# EAGLE schematic ANET3D_Board (EAGLE 6.6.0)
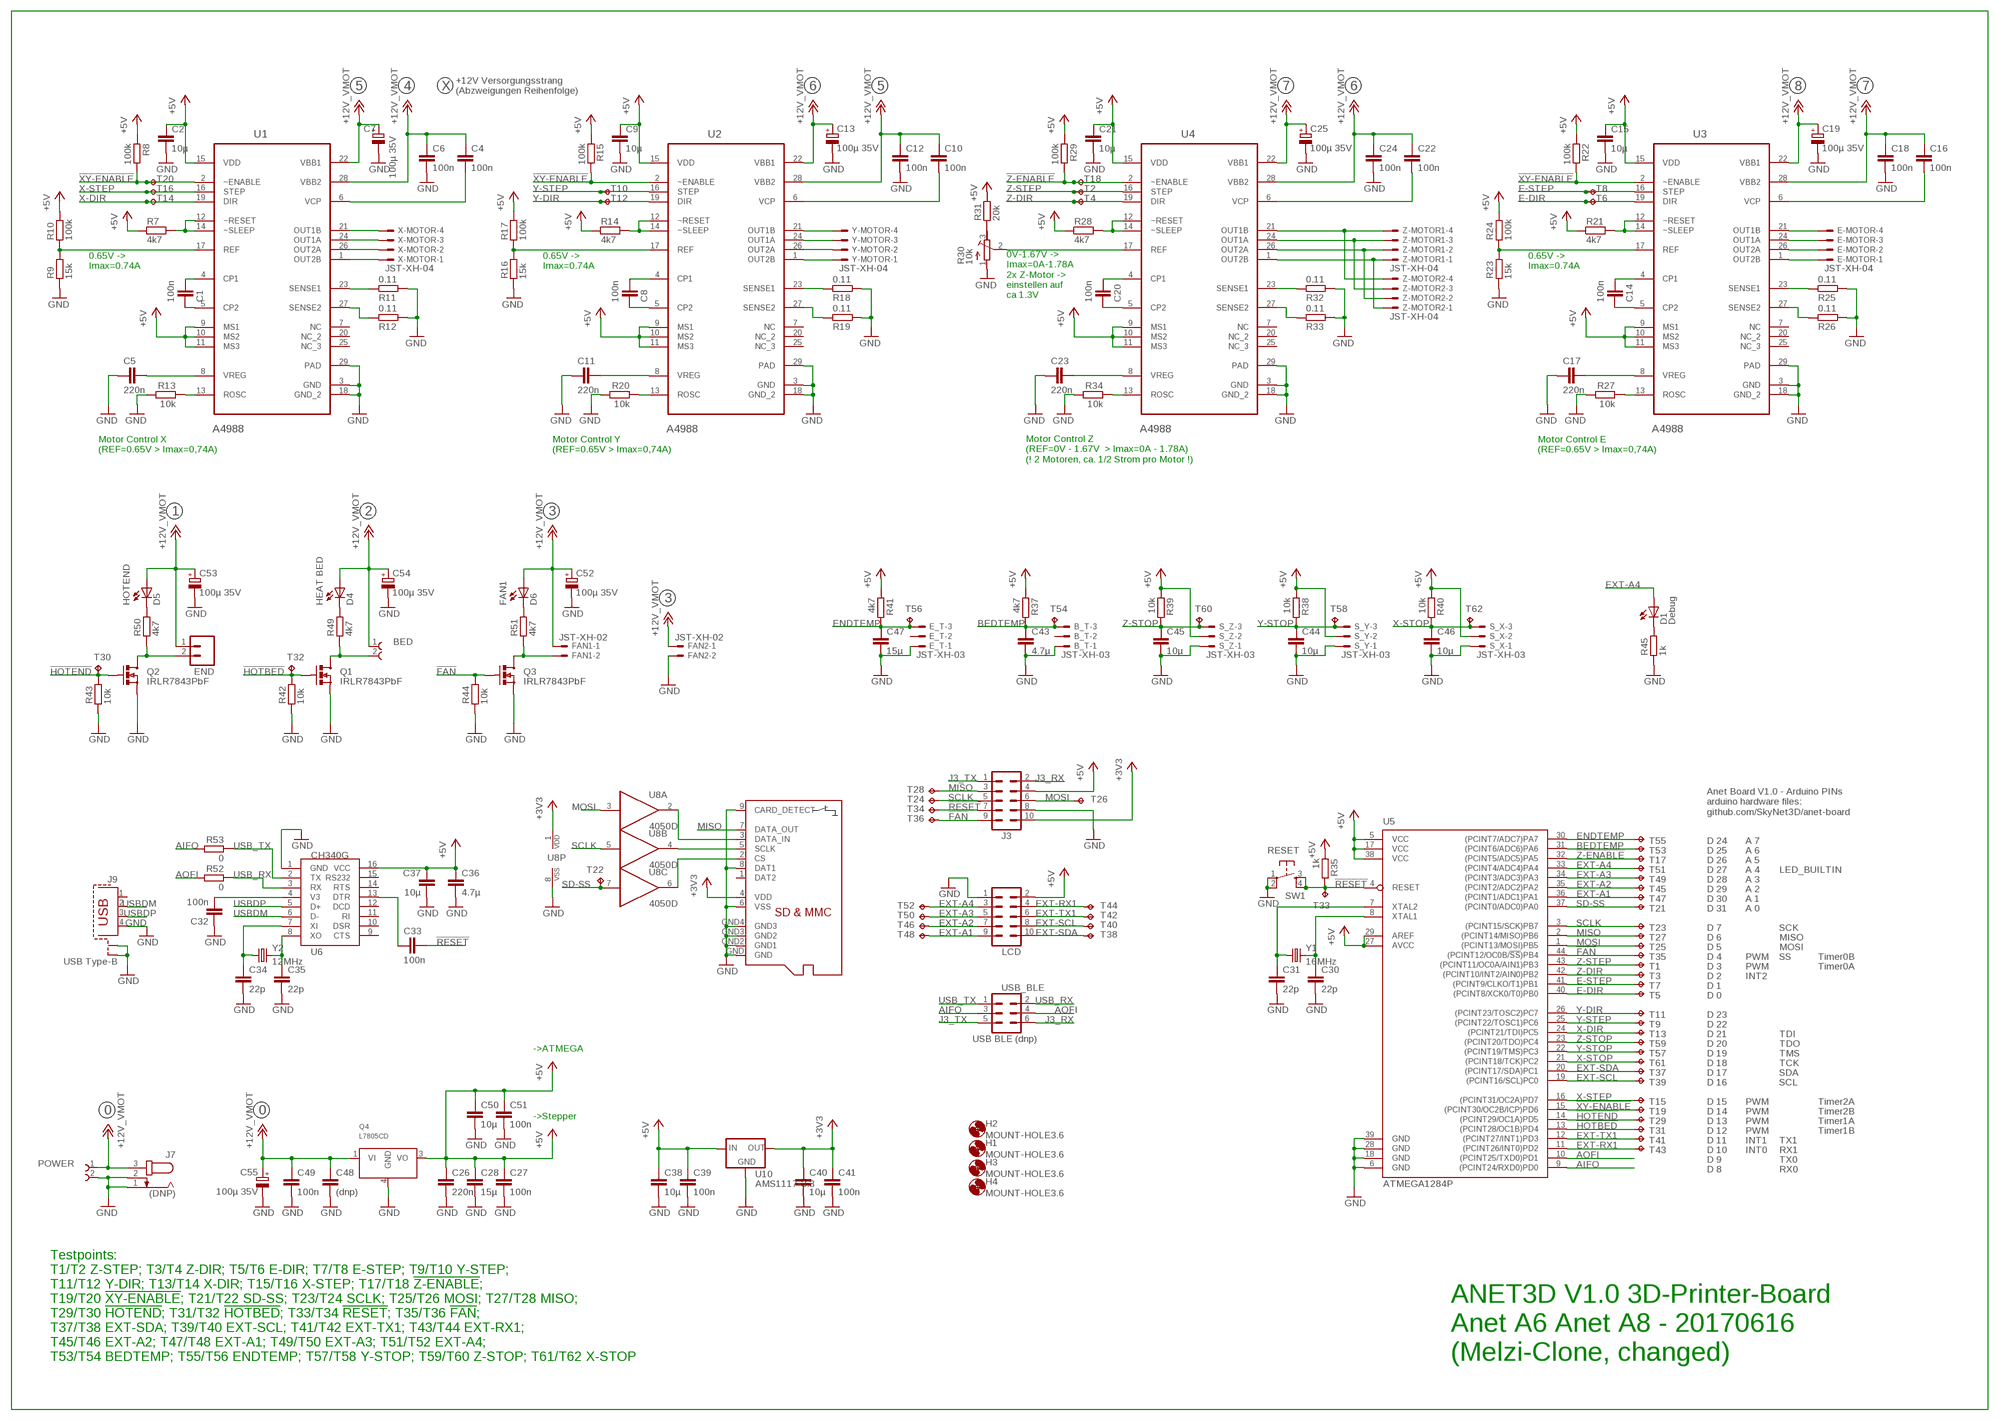
[diagram p0: schematic, sheet 1]

## Parts
B_T  JST-XH-03  JST-XH-03-PIN-ROUND-PAD  [JST-XH-03-PACKAGE-ROUND-PAD]
BED  691311400002  [691311400002]
C1  100n  C-EUC0805  [C0805]
C2  10µ  C-EUC0805  [C0805]
C4  100n  C-EUC0805  [C0805]
C5  220n  C-EUC0805  [C0805]
C6  100n  C-EUC0805  [C0805]
C7  100µ 35V  CPOL-EUD  [PANASONIC_D]
C8  100n  C-EUC0805  [C0805]
C9  10µ  C-EUC0805  [C0805]
C10  100n  C-EUC0805  [C0805]
C11  220n  C-EUC0805  [C0805]
C12  100n  C-EUC0805  [C0805]
C13  100µ 35V  CPOL-EUD  [PANASONIC_D]
C14  100n  C-EUC0805  [C0805]
C15  10µ  C-EUC0805  [C0805]
C16  100n  C-EUC0805  [C0805]
C17  220n  C-EUC0805  [C0805]
C18  100n  C-EUC0805  [C0805]
C19  100µ 35V  CPOL-EUD  [PANASONIC_D]
C20  100n  C-EUC0805  [C0805]
C21  10µ  C-EUC0805  [C0805]
C22  100n  C-EUC0805  [C0805]
C23  220n  C-EUC0805  [C0805]
C24  100n  C-EUC0805  [C0805]
C25  100µ 35V  CPOL-EUD  [PANASONIC_D]
C26  220n  C-EUC0805  [C0805]
C27  100n  C-EUC0805  [C0805]
C28  15µ  C-EUC0805  [C0805]
C30  22p  C-EUC0805  [C0805]
C31  22p  C-EUC0805  [C0805]
C32  100n  C-EUC0805  [C0805]
C33  100n  C-EUC0805  [C0805]
C34  22p  C-EUC0805  [C0805]
C35  22p  C-EUC0805  [C0805]
C36  4.7µ  C-EUC0805  [C0805]
C37  10µ  C-EUC0805  [C0805]
C38  10µ  C-EUC0805  [C0805]
C39  100n  C-EUC0805  [C0805]
C40  10µ  C-EUC0805  [C0805]
C41  100n  C-EUC0805  [C0805]
C43  4.7µ  C-EUC0805  [C0805]
C44  10µ  C-EUC0805  [C0805]
C45  10µ  C-EUC0805  [C0805]
C46  10µ  C-EUC0805  [C0805]
C47  15µ  C-EUC0805  [C0805]
C48  (dnp)  C-EUC0805  [C0805]
C49  100n  C-EUC0805  [C0805]
C50  10µ  C-EUC0805  [C0805]
C51  100n  C-EUC0805  [C0805]
C52  100µ 35V  CPOL-EUD  [PANASONIC_D]
C53  100µ 35V  CPOL-EUD  [PANASONIC_D]
C54  100µ 35V  CPOL-EUD  [PANASONIC_D]
C55  100µ 35V  CPOL-EUD  [PANASONIC_D]
D1  Debug  LEDCHIPLED_0805  [CHIPLED_0805]
D4  HEAT BED  LEDCHIPLED_0805  [CHIPLED_0805]
D5  HOTEND  LEDCHIPLED_0805  [CHIPLED_0805]
D6  FAN1  LEDCHIPLED_0805  [CHIPLED_0805]
E-MOTOR  JST-XH-04  JST-XH-04-PIN-ROUND-PAD  [JST-XH-04-PACKAGE-ROUND-PAD]
E_T  JST-XH-03  JST-XH-03-PIN-ROUND-PAD  [JST-XH-03-PACKAGE-ROUND-PAD]
END  M025MM  [SCREWTERMINAL-5MM-2]
FAN1  JST-XH-02  JST-XH-02-PIN-ROUND-PAD  [JST-XH-02-PACKAGE-ROUND-PAD]
FAN2  JST-XH-02  JST-XH-02-PIN-ROUND-PAD  [JST-XH-02-PACKAGE-ROUND-PAD]
H1  MOUNT-HOLE3.6  [3,6]
H2  MOUNT-HOLE3.6  [3,6]
H3  MOUNT-HOLE3.6  [3,6]
H4  MOUNT-HOLE3.6  [3,6]
J3  J3  ML10  [ML10]
J7  (DNP)  JACK-PLUG1  [SPC4078]
J9  USB Type-B  PN61729-S  [PN61729-S]
LCD  LCD  ML10  [ML10]
POWER  691311400002  [691311400002]
Q1  IRLR7843PbF  MOSFET-NCHANNELFDD8580  [DPAK]
Q2  IRLR7843PbF  MOSFET-NCHANNELFDD8580  [DPAK]
Q3  IRLR7843PbF  MOSFET-NCHANNELFDD8580  [DPAK]
Q4  L7805CD  78XX  [D2PACK]
R7  4k7  RESISTOR_0805  [RESC2012X70N]
R8  100k  RESISTOR_0805  [RESC2012X70N]
R9  15k  RESISTOR_0805  [RESC2012X70N]
R10  100k  RESISTOR_0805  [RESC2012X70N]
R11  0.11  RESISTOR_0805  [RESC2012X70N]
R12  0.11  RESISTOR_0805  [RESC2012X70N]
R13  10k  RESISTOR_0805  [RESC2012X70N]
R14  4k7  RESISTOR_0805  [RESC2012X70N]
R15  100k  RESISTOR_0805  [RESC2012X70N]
R16  15k  RESISTOR_0805  [RESC2012X70N]
R17  100k  RESISTOR_0805  [RESC2012X70N]
R18  0.11  RESISTOR_0805  [RESC2012X70N]
R19  0.11  RESISTOR_0805  [RESC2012X70N]
R20  10k  RESISTOR_0805  [RESC2012X70N]
R21  4k7  RESISTOR_0805  [RESC2012X70N]
R22  100k  RESISTOR_0805  [RESC2012X70N]
R23  15k  RESISTOR_0805  [RESC2012X70N]
R24  100k  RESISTOR_0805  [RESC2012X70N]
R25  0.11  RESISTOR_0805  [RESC2012X70N]
R26  0.11  RESISTOR_0805  [RESC2012X70N]
R27  10k  RESISTOR_0805  [RESC2012X70N]
R28  4k7  RESISTOR_0805  [RESC2012X70N]
R29  100k  RESISTOR_0805  [RESC2012X70N]
R30  10k  R-TRIMM3374  [RTRIM3374]
R31  20k  RESISTOR_0805  [RESC2012X70N]
R32  0.11  RESISTOR_0805  [RESC2012X70N]
R33  0.11  RESISTOR_0805  [RESC2012X70N]
R34  10k  RESISTOR_0805  [RESC2012X70N]
R35  1k  RESISTOR_0805  [RESC2012X70N]
R37  4k7  RESISTOR_0805  [RESC2012X70N]
R38  10k  RESISTOR_0805  [RESC2012X70N]
R39  10k  RESISTOR_0805  [RESC2012X70N]
R40  10k  RESISTOR_0805  [RESC2012X70N]
R41  4k7  RESISTOR_0805  [RESC2012X70N]
R42  10k  RESISTOR_0805  [RESC2012X70N]
R43  10k  RESISTOR_0805  [RESC2012X70N]
R44  10k  RESISTOR_0805  [RESC2012X70N]
R45  1k  RESISTOR_0805  [RESC2012X70N]
R49  4k7  RESISTOR_0805  [RESC2012X70N]
R50  4k7  RESISTOR_0805  [RESC2012X70N]
R51  4k7  RESISTOR_0805  [RESC2012X70N]
R52  0  RESISTOR_0805  [RESC2012X70N]
R53  0  RESISTOR_0805  [RESC2012X70N]
S_X  JST-XH-03  JST-XH-03-PIN-ROUND-PAD  [JST-XH-03-PACKAGE-ROUND-PAD]
S_Y  JST-XH-03  JST-XH-03-PIN-ROUND-PAD  [JST-XH-03-PACKAGE-ROUND-PAD]
S_Z  JST-XH-03  JST-XH-03-PIN-ROUND-PAD  [JST-XH-03-PACKAGE-ROUND-PAD]
SD  MICRO-SD-PP  [MICRO-SD-PP]
SW1  RESET  TAC_SWITCHSMD  [TACTILE_SWITCH_SMD]
T1  TPTP09R  [TP09R]
T2  TPTP09R  [TP09R]
T3  TPTP09R  [TP09R]
T4  TPTP09R  [TP09R]
T5  TPTP09R  [TP09R]
T6  TPTP09R  [TP09R]
T7  TPTP09R  [TP09R]
T8  TPTP09R  [TP09R]
T9  TPTP09R  [TP09R]
T10  TPTP09R  [TP09R]
T11  TPTP09R  [TP09R]
T12  TPTP09R  [TP09R]
T13  TPTP09R  [TP09R]
T14  TPTP09R  [TP09R]
T15  TPTP09R  [TP09R]
T16  TPTP09R  [TP09R]
T17  TPTP09R  [TP09R]
T18  TPTP09R  [TP09R]
T19  TPTP09R  [TP09R]
T20  TPTP09R  [TP09R]
T21  TPTP09R  [TP09R]
T22  TPTP09R  [TP09R]
T23  TPTP09R  [TP09R]
T24  TPTP09R  [TP09R]
T25  TPTP09R  [TP09R]
T26  TPTP09R  [TP09R]
T27  TPTP09R  [TP09R]
T28  TPTP09R  [TP09R]
T29  TPTP09R  [TP09R]
T30  TPTP09R  [TP09R]
T31  TPTP09R  [TP09R]
T32  TPTP09R  [TP09R]
T33  TPTP09R  [TP09R]
T34  TPTP09R  [TP09R]
T35  TPTP09R  [TP09R]
T36  TPTP09R  [TP09R]
T37  TPTP09R  [TP09R]
T38  TPTP09R  [TP09R]
T39  TPTP09R  [TP09R]
T40  TPTP09R  [TP09R]
T41  TPTP09R  [TP09R]
T42  TPTP09R  [TP09R]
T43  TPTP09R  [TP09R]
T44  TPTP09R  [TP09R]
T45  TPTP09R  [TP09R]
T46  TPTP09R  [TP09R]
T47  TPTP09R  [TP09R]
T48  TPTP09R  [TP09R]
T49  TPTP09R  [TP09R]
T50  TPTP09R  [TP09R]
T51  TPTP09R  [TP09R]
T52  TPTP09R  [TP09R]
T53  TPTP09R  [TP09R]
T54  TPTP09R  [TP09R]
T55  TPTP09R  [TP09R]
T56  TPTP09R  [TP09R]
T57  TPTP09R  [TP09R]
T58  TPTP09R  [TP09R]
T59  TPTP09R  [TP09R]
T60  TPTP09R  [TP09R]
T61  TPTP09R  [TP09R]
T62  TPTP09R  [TP09R]
U1  A4988  A4988SETTR-T-RE  [QFN50P500X500X100-29N]
U2  A4988  A4988SETTR-T-RE  [QFN50P500X500X100-29N]
U3  A4988  A4988SETTR-T-RE  [QFN50P500X500X100-29N]
U4  A4988  A4988SETTR-T-RE  [QFN50P500X500X100-29N]
U5  ATMEGA1284P  ATMEGA644A  [TQFP44]
U6  CH340G  [SOIC16]
U8  4050D  [SO16]
U10  AMS1117-3.3  LM1117DTX-SOT89  [SOT89]
USB_BLE  USB BLE (dnp)  MA03-2  [MA03-2]
X-MOTOR  JST-XH-04  JST-XH-04-PIN-ROUND-PAD  [JST-XH-04-PACKAGE-ROUND-PAD]
Y1  16MHz  CRYSTALSM49  [SM49]
Y2  12MHz  CRYSTALSM49  [SM49]
Y-MOTOR  JST-XH-04  JST-XH-04-PIN-ROUND-PAD  [JST-XH-04-PACKAGE-ROUND-PAD]
Z-MOTOR1  JST-XH-04  JST-XH-04-PIN-ROUND-PAD  [JST-XH-04-PACKAGE-ROUND-PAD]
Z-MOTOR2  JST-XH-04  JST-XH-04-PIN-ROUND-PAD  [JST-XH-04-PACKAGE-ROUND-PAD]

## Nets
0: C32.2 U6.4(V3)
!FAN: J3.9 Q3.1(G) R44.2 T35.TP T36.TP U5.44((PCINT12/OC0B/!SS!)PB4)
!HOTBED: Q1.1(G) R42.2 T31.TP T32.TP U5.13((PCINT28/OC1B)PD4)
!HOTEND: Q2.1(G) R43.2 T29.TP T30.TP U5.14((PCINT29/OC1A)PD5)
!RESET: C33.2 J3.7 R35.2 SW1.3 SW1.4 T33.TP T34.TP U5.4(RESET)
!XY-ENABLE: R8.2 R15.2 R22.2 T19.TP T20.TP U1.2(~ENABLE) U2.2(~ENABLE) U3.2(~ENABLE) U5.15((PCINT30/OC2B/ICP)PD6)
!Z-ENABLE: R29.2 T17.TP T18.TP U4.2(~ENABLE) U5.32((PCINT5/ADC5)PA5)
+3V3: C40.1 C41.1 J3.10 SD.4(VDD) U8.1(P:VDD) U10.2(OUT)
+5V [power]: C2.1 C9.1 C15.1 C21.1 C26.1 C27.1 C28.1 C36.1 C37.1 C38.1 C39.1 C50.1 C51.1 J3.4 LCD.2 Q4.3(VO) R7.1 R8.1 R10.2 R14.1 R15.1 R17.2 R21.1 R22.1 R24.2 R28.1 R29.1 R31.2 R35.1 R37.1 R38.1 R39.1 R40.1 R41.1 S_X.2 S_Y.2 S_Z.2 U1.9(MS1) U1.10(MS2) U1.11(MS3) U1.15(VDD) U2.9(MS1) U2.10(MS2) U2.11(MS3) U2.15(VDD) U3.9(MS1) U3.10(MS2) U3.11(MS3) U3.15(VDD) U4.9(MS1) U4.10(MS2) U4.11(MS3) U4.15(VDD) U5.5(VCC) U5.17(VCC) U5.27(AVCC) U5.29(AREF) U5.38(VCC) U6.16(VCC) U10.3(IN)
+12V: BED.1 C4.1 C6.1 C7.+ C10.1 C12.1 C13.+ C16.1 C18.1 C19.+ C22.1 C24.1 C25.+ C48.1 C49.1 C52.+ C53.+ C54.+ C55.+ D4.A D5.A D6.A END.1 FAN1.1 FAN2.1 J7.3 POWER.1 Q4.1(VI) U1.22(VBB1) U1.28(VBB2) U2.22(VBB1) U2.28(VBB2) U3.22(VBB1) U3.28(VBB2) U4.22(VBB1) U4.28(VBB2) ; supply symbol labelled +12V_VMOT
AIFO: R53.2 U5.9((PCINT24/RXD0)PD0) USB_BLE.3
AOFI: R52.2 U5.10((PCINT25/TXD0)PD1) USB_BLE.4
BEDTEMP: B_T.3 C43.1 R37.2 T53.TP T54.TP U5.31((PCINT6/ADC6)PA6)
E-DIR: T5.TP T6.TP U3.19(DIR) U5.40((PCINT8/XCK0/T0)PB0)
E-STEP: T7.TP T8.TP U3.16(STEP) U5.41((PCINT9/CLKO/T1)PB1)
ENDTEMP: C47.1 E_T.3 R41.2 T55.TP T56.TP U5.30((PCINT7/ADC7)PA7)
EXT-A1: LCD.9 T47.TP T48.TP U5.36((PCINT1/ADC1)PA1)
EXT-A2: LCD.7 T45.TP T46.TP U5.35((PCINT2/ADC2)PA2)
EXT-A3: LCD.5 T49.TP T50.TP U5.34((PCINT3/ADC3)PA3)
EXT-A4: D1.A LCD.3 T51.TP T52.TP U5.33((PCINT4/ADC4)PA4)
EXT-RX1: LCD.4 T43.TP T44.TP U5.11((PCINT26/INT0)PD2)
EXT-SCL: LCD.8 T39.TP T40.TP U5.19((PCINT16/SCL)PC0)
EXT-SDA: LCD.10 T37.TP T38.TP U5.20((PCINT17/SDA)PC1)
EXT-TX1: LCD.6 T41.TP T42.TP U5.12((PCINT27/INT1)PD3)
GND: B_T.1 C2.2 C5.1 C6.2 C7.- C9.2 C11.1 C12.2 C13.- C15.2 C17.1 C18.2 C19.- C21.2 C23.1 C24.2 C25.- C26.2 C27.2 C28.2 C30.2 C31.2 C32.1 C34.2 C35.2 C36.2 C37.2 C38.2 C39.2 C40.2 C41.2 C43.2 C44.2 C45.2 C46.2 C47.2 C48.2 C49.2 C50.2 C51.2 C52.- C53.- C54.- C55.- E_T.1 FAN2.2 J3.8 J7.1 J7.2 J9.4 J9.S1 J9.S2 LCD.1 POWER.2 Q1.3(S) Q2.3(S) Q3.3(S) Q4.4(GND) R9.1 R11.2 R12.2 R13.2 R16.1 R18.2 R19.2 R20.2 R23.1 R25.2 R26.2 R27.2 R30.1(A) R32.2 R33.2 R34.2 R42.1 R43.1 R44.1 R45.1 S_X.1 S_Y.1 S_Z.1 SD.6(VSS) SD.8(DAT1) SD.9(CARD_DETECT) SD.GND SD.GND2(GND1) SD.GND3(GND2) SD.GND4(GND3) SW1.1 SW1.2 U1.3(GND) U1.18(GND_2) U1.29(PAD) U2.3(GND) U2.18(GND_2) U2.29(PAD) U3.3(GND) U3.18(GND_2) U3.29(PAD) U4.3(GND) U4.18(GND_2) U4.29(PAD) U5.6(GND) U5.18(GND) U5.28(GND) U5.39(GND) U6.1(GND) U8.8(P:VSS) U10.1(GND)
HOTBED-GND [power]: BED.2 Q1.4(D) R49.1
HOTBED-GND3 [power]: END.2 Q2.4(D) R50.1
HOTBED-GND4 [power]: FAN1.2 Q3.4(D) R51.1
J3_RX: J3.2 USB_BLE.6
J3_TX: J3.1 USB_BLE.5
MISO: J3.3 SD.7(DATA_OUT) T27.TP T28.TP U5.2((PCINT14/MISO)PB6)
MOSI: J3.6 T25.TP T26.TP U5.1((PCINT13/MOSI)PB5) U8.3(A:I)
N$1: R13.1 U1.13(ROSC)
N$2: D4.C R49.2
N$3: D5.C R50.2
N$4: C5.2 U1.8(VREG)
N$5: C1.2 U1.4(CP1)
N$6: C1.1 U1.5(CP2)
N$7: D6.C R51.2
N$8: R7.2 U1.12(~RESET) U1.14(~SLEEP)
N$9: C4.2 U1.6(VCP)
N$10: D1.C R45.2
N$11: C31.1 U5.7(XTAL2) Y1.1
N$12: SD.3(DATA_IN) U8.2(A:O)
N$13: SD.5(SCLK) U8.4(B:O)
N$14: SD.2(CS) U8.6(C:O)
N$15: C30.1 U5.8(XTAL1) Y1.2
N$16: U1.1(OUT2B) X-MOTOR.1
N$17: U1.21(OUT1B) X-MOTOR.4
N$18: C33.1 U6.13(DTR)
N$19: U1.26(OUT2A) X-MOTOR.2
N$20: U1.24(OUT1A) X-MOTOR.3
N$21: R12.1 U1.27(SENSE2)
N$22: U4.24(OUT1A) Z-MOTOR1.3 Z-MOTOR2.3
N$23: U4.26(OUT2A) Z-MOTOR1.2 Z-MOTOR2.2
N$24: U4.21(OUT1B) Z-MOTOR1.4 Z-MOTOR2.4
N$25: U4.1(OUT2B) Z-MOTOR1.1 Z-MOTOR2.1
N$26: C34.1 U6.7(XI) Y2.1
N$27: R32.1 U4.23(SENSE1)
N$28: R33.1 U4.27(SENSE2)
N$29: C20.2 U4.4(CP1)
N$30: C20.1 U4.5(CP2)
N$31: R34.1 U4.13(ROSC)
N$32: R11.1 U1.23(SENSE1)
N$33: C23.2 U4.8(VREG)
N$34: R28.2 U4.12(~RESET) U4.14(~SLEEP)
N$35: C22.2 U4.6(VCP)
N$36: R30.3(E) R31.1
N$37: R30.2(S) U4.17(REF)
N$38: E-MOTOR.3 U3.24(OUT1A)
N$39: U2.21(OUT1B) Y-MOTOR.4
N$40: U2.26(OUT2A) Y-MOTOR.2
N$41: E-MOTOR.1 U3.1(OUT2B)
N$42: R25.1 U3.23(SENSE1)
N$43: R26.1 U3.27(SENSE2)
N$44: C14.2 U3.4(CP1)
N$45: C14.1 U3.5(CP2)
N$46: R27.1 U3.13(ROSC)
N$47: C17.2 U3.8(VREG)
N$48: R21.2 U3.12(~RESET) U3.14(~SLEEP)
N$49: C16.2 U3.6(VCP)
N$50: E-MOTOR.4 U3.21(OUT1B)
N$51: E-MOTOR.2 U3.26(OUT2A)
N$78: C35.1 U6.8(XO) Y2.2
N$96: U2.24(OUT1A) Y-MOTOR.3
N$99: U2.1(OUT2B) Y-MOTOR.1
N$100: R18.1 U2.23(SENSE1)
N$101: R19.1 U2.27(SENSE2)
N$102: C8.2 U2.4(CP1)
N$103: C8.1 U2.5(CP2)
N$104: R20.1 U2.13(ROSC)
N$105: C11.2 U2.8(VREG)
N$106: R14.2 U2.12(~RESET) U2.14(~SLEEP)
N$107: C10.2 U2.6(VCP)
REF1: R9.2 R10.1 U1.17(REF)
REF2: R16.2 R17.1 U2.17(REF)
REF3: R23.2 R24.1 U3.17(REF)
SCLK: J3.5 T23.TP T24.TP U5.3((PCINT15/SCK)PB7) U8.5(B:I)
SD-SS: T21.TP T22.TP U5.37((PCINT0/ADC0)PA0) U8.7(C:I)
USB_RX: R52.1 U6.3(RX) USB_BLE.2
USB_TX: R53.1 U6.2(TX) USB_BLE.1
USBDM: J9.2 U6.6(D-)
USBDP: J9.3 U6.5(D+)
X-DIR: T13.TP T14.TP U1.19(DIR) U5.24((PCINT21/TDI)PC5)
X-STEP: T15.TP T16.TP U1.16(STEP) U5.16((PCINT31/OC2A)PD7)
X-STOP: C46.1 R40.2 S_X.3 T61.TP T62.TP U5.21((PCINT18/TCK)PC2)
Y-DIR: T11.TP T12.TP U2.19(DIR) U5.26((PCINT23/TOSC2)PC7)
Y-STEP: T9.TP T10.TP U2.16(STEP) U5.25((PCINT22/TOSC1)PC6)
Y-STOP: C44.1 R38.2 S_Y.3 T57.TP T58.TP U5.22((PCINT19/TMS)PC3)
Z-DIR: T3.TP T4.TP U4.19(DIR) U5.42((PCINT10/INT2/AIN0)PB2)
Z-STEP: T1.TP T2.TP U4.16(STEP) U5.43((PCINT11/OC0A/AIN1)PB3)
Z-STOP: C45.1 R39.2 S_Z.3 T59.TP T60.TP U5.23((PCINT20/TDO)PC4)
Unconnected: B_T.2 E_T.2 J9.1 SD.1(DAT2) U1.7(NC) U1.20(NC_2) U1.25(NC_3) U2.7(NC) U2.20(NC_2) U2.25(NC_3) U3.7(NC) U3.20(NC_2) U3.25(NC_3) U4.7(NC) U4.20(NC_2) U4.25(NC_3) U6.9(CTS) U6.10(DSR) U6.11(RI) U6.12(DCD) U6.14(RTS) U6.15(RS232) U8.9(D:I) U8.10(D:O) U8.11(E:I) U8.12(E:O) U8.14(F:I) U8.15(F:O)

## Notes on the sheet
- 5 | 4 | X
- +12V Versorgungsstrang
  (Abzweigungen Reihenfolge)
- 6 | 5 | 7 | 6 | 8 | 7
- 0.65V ->
  Imax=0.74A
- 0.65V ->
  Imax=0.74A
- 0.65V ->
  Imax=0.74A
- 0V-1.67V ->
  Imax=0A-1.78A
  2x Z-Motor ->
  einstellen auf
  ca 1.3V
- Motor Control X
  (REF=0.65V > Imax=0,74A)
- Motor Control Y
  (REF=0.65V > Imax=0,74A)
- Motor Control E
  (REF=0.65V > Imax=0,74A)
- Motor Control Z
  (REF=0V - 1.67V  > Imax=0A - 1.78A)
  (! 2 Motoren, ca. 1/2 Strom pro Motor !)
- 1 | 2 | 3
- 3
- Anet Board V1.0 - Arduino PINs
  arduino hardware files:
  github.com/SkyNet3D/anet-board
- D 24 | A 7
- D 25 | A 6
- D 26 | A 5
- D 27 | A 4 | LED_BUILTIN
- D 28 | A 3
- D 29 | A 2
- D 30 | A 1
- D 31 | A 0
- D 7 | SCK
- D 6 | MISO
- D 5 | MOSI
- U6
- D 4 | PWM | SS | Timer0B
- D 3 | PWM | Timer0A
- D 2 | INT2
- D 1
- D 0
- D 23
- D 22
- D 21 | TDI
- D 20 | TDO
- ->ATMEGA
- D 19 | TMS
- D 18 | TCK
- D 17 | SDA
- D 16 | SCL
- D 15 | PWM | Timer2A
- 0 | 0
- D 14 | PWM | Timer2B
- ->Stepper
- D 13 | PWM | Timer1A
- D 12 | PWM | Timer1B
- D 11 | INT1 | TX1
- D 10 | INT0 | RX1
- D 9 | TX0
- D 8 | RX0
- Testpoints:
  T1/T2 Z-STEP; T3/T4 Z-DIR; T5/T6 E-DIR; T7/T8 E-STEP; T9/T10 Y-STEP;
  T11/T12 Y-DIR; T13/T14 X-DIR; T15/T16 X-STEP; T17/T18 !Z-ENABLE!;
  T19/T20 !XY-ENABLE!; T21/T22 SD-SS; T23/T24 SCLK; T25/T26 MOSI; T27/T28 MISO;
  T29/T30 !HOTEND!; T31/T32 !HOTBED!; T33/T34 !RESET!; T35/T36 !FAN!;
  T37/T38 EXT-SDA; T39/T40 EXT-SCL; T41/T42 EXT-TX1; T43/T44 EXT-RX1;
  T45/T46 EXT-A2; T47/T48 EXT-A1; T49/T50 EXT-A3; T51/T52 EXT-A4;
  T53/T54 BEDTEMP; T55/T56 ENDTEMP; T57/T58 Y-STOP; T59/T60 Z-STOP; T61/T62 X-STOP
- ANET3D V1.0 3D-Printer-Board
  Anet A6 Anet A8 - 20170616
  (Melzi-Clone, changed)

## Library data of the parts
B_T E_T S_X S_Y S_Z = Rembrandt Electronics - JST XH Connectors v1-0:JST-XH-03-PIN: JST XH Connector 2 Pin Wire to board connector. Pitch: 2,54 mm, (0.100") Number of pins: 3 Created by Rembrandt Electronics www.rembrandtelectronics.com
BED POWER = EAGLE-TERMINAL_BLOCKS-rev16e:691311400002: WR-TBL Serie 3114 - 7.62 mm Open Vertical PCB Header , 2 Pins=>Code : Con_TBL_Pluggable_7.62_PCB_V_691311400002 <http://katalog.we-online.de/media/images/eican/Con_TBL_Pluggable_7.62_PCB_V_6913114000xx_pf2.jpg> Details see: http://katalog.we-online.de/en/em/TBL_7_62_3114_OPEN_VERTICAL_PCB_HEADER_69131140000X Created 2014-06-25, Karrer Zheng 2014 (C) Würth Elektronik
C1 C2 C4-C6 C8-C12 C14-C18 C20-C24 C26-C28 C30-C41 C43-C51 = rcl:C-EU: CAPACITOR, European symbol
C7 C13 C19 C25 C52-C55 = rcl:CPOL-EU: POLARIZED CAPACITOR, European symbol
D1 D4-D6 = led:LED: LED OSRAM: - CHIPLED LG R971, LG N971, LY N971, LG Q971, LY Q971, LO R971, LY R971 LH N974, LH R974 LS Q976, LO Q976, LY Q976 LO Q996 - Hyper CHIPLED LW Q18S LB Q993, LB Q99A, LB R99A - SideLED LS A670, LO A670, LY A670, LG A670, LP A670 LB A673, LV A673, LT A673, LW A673 LH A674 LY A675 LS A676, LA A676, LO A676, LY A676, LW A676 LS A679, LY A679, LG A679 - Hyper Micro SIDELED® LS Y876, LA Y876, LO Y876, LY Y876 LT Y87S - SmartLED LW L88C, LW L88S LB L89C, LB L89S, LG L890 LS L89K, LO L89K, LY L89K LS L896, LA L896, LO L896, LY L896 - TOPLED LS T670, LO T670, LY T670, LG T670, LP T670 LSG T670, LSP T670, LSY T670, LOP T670, LYG T670 LG T671, LOG T671, LSG T671 LB T673, LV T673, LT T673, LW T673 LH T674 LS T676, LA T676, LO T676, LY T676, LB T676, LH T676, LSB T676, LW T676 LB T67C, LV T67C, LT T67C, LS T67K, LO T67K, LY T67K, LW E67C LS E67B, LA E67B, LO E67B, LY E67B, LB E67C, LV E67C, LT E67C LW T67C LS T679, LY T679, LG T679 LS T770, LO T770, LY T770, LG T770, LP T770 LB T773, LV T773, LT T773, LW T773 LH T774 LS E675, LA E675, LY E675, LS T675 LS T776, LA T776, LO T776, LY T776, LB T776 LHGB T686 LT T68C, LB T68C - Hyper Mini TOPLED® LB M676 - Mini TOPLED Santana® LG M470 LS M47K, LO M47K, LY M47K Source: http://www.osram.convergy.de LUXEON: - LUMILED® LXK2-PW12-R00, LXK2-PW12-S00, LXK2-PW14-U00, LXK2-PW14-V00 LXK2-PM12-R00, LXK2-PM12-S00, LXK2-PM14-U00 LXK2-PE12-Q00, LXK2-PE12-R00, LXK2-PE12-S00, LXK2-PE14-T00, LXK2-PE14-U00 LXK2-PB12-K00, LXK2-PB12-L00, LXK2-PB12-M00, LXK2-PB14-N00, LXK2-PB14-P00, LXK2-PB14-Q00 LXK2-PR12-L00, LXK2-PR12-M00, LXK2-PR14-Q00, LXK2-PR14-R00 LXK2-PD12-Q00, LXK2-PD12-R00, LXK2-PD12-S00 LXK2-PH12-R00, LXK2-PH12-S00 LXK2-PL12-P00, LXK2-PL12-Q00, LXK2-PL12-R00 Source: www.luxeon.com KINGBRIGHT: KA-3528ASYC Source: www.kingbright.com
E-MOTOR X-MOTOR Y-MOTOR Z-MOTOR1 Z-MOTOR2 = Rembrandt Electronics - JST XH Connectors v1-0:JST-XH-04-PIN: JST XH Connector 2 Pin Wire to board connector. Pitch: 2,54 mm, (0.100") Number of pins: 4 Created by Rembrandt Electronics www.rembrandtelectronics.com
END = SparkFun:M02: Header 2 Standard 2-pin 0.1" header. Use with straight break away headers (SKU : PRT-00116), right angle break away headers (PRT-00553), swiss pins (PRT-00743), machine pins (PRT-00117), and female headers (PRT-00115). Molex polarized connector foot print use with SKU : PRT-08233 with associated crimp pins and housings.
FAN1 FAN2 = Rembrandt Electronics - JST XH Connectors v1-0:JST-XH-02-PIN: JST XH Connector 2 Pin Wire to board connector. Pitch: 2,54 mm, (0.100") Number of pins: 2 Created by Rembrandt Electronics www.rembrandtelectronics.com
H1-H4 = holes:MOUNT-HOLE: MOUNTING HOLE with drill center marker
J3 LCD = con-harting-ml:ML10: HARTING; OC_FARNELL: unknown; OC_NEWARK: unknown
J7 = con-jack:JACK-PLUG: DC POWER JACK Power Jack, DC, Right Angle, Through Hole, Rated 5A at 16VDC, PC Terminals Distributor: Farnell (www.Farnell.de) Drawing: 84N1161.pdf / 84N1162.pdf Manufacturer: SPC Technology (www.spctechnology.com) Type: SPC4077 / SPC 4078; OC_FARNELL: unknown; OC_NEWARK: unknown
J9 = ANET3D_Board:PN61729-S: BERG USB connector; OC_FARNELL: unknown; OC_NEWARK: unknown
Q1-Q3 = SparkFun:MOSFET-NCHANNEL
Q4 = Simplex-ICs:78XX: 78xx positive voltage linear regulators
R7-R29 R31-R35 R37-R45 R49-R53 = ipc-7351-resistor:RESISTOR_
R30 = rcl:R-TRIMM: Trimm resistor
SD = microSD-PushPush:MICRO-SD-PP: Micro SD (MircorSD) Socket Push-Push Type
SW1 = SparkFun:TAC_SWITCH: Momentary Switch Button commonly used for reset or general input. Spark Fun Electronics SKU : COM-00097
T1-T62 = testpad:TP: Test pad
U1-U4 = Allegro_By_element14_Batch_1:A4988SETTR-T-RE: DMOS Microstepping Driver with Translator and Overcurrent Protection; MPN: A4988SETTR-T; PACKAGE: QFN-28; SUPPLIER: Allegro
U5 = atmel:ATMEGA644: 8-bit Microcontroller with 64K Bytes In-System Programmable Flash Source: http://www.atmel.com/dyn/resources/prod_documents/doc2593.pdf; MPN: ATMEGA644PV-10AU; OC_FARNELL: 1455123; OC_NEWARK: 58M3748
U6 = ch340g:CH340G
U8 = 40xx:4050: Hex non-inverting BUFFER
U10 = lm1117:LM1117DTX-*
USB_BLE = con-lstb:MA03-2: PIN HEADER; OC_FARNELL: unknown; OC_NEWARK: unknown
Y1 Y2 = crystal:CRYSTAL: CRYSTAL; OC_FARNELL: unknown; OC_NEWARK: unknown